# EAGLE design blinds_new (EAGLE 8.6.0)
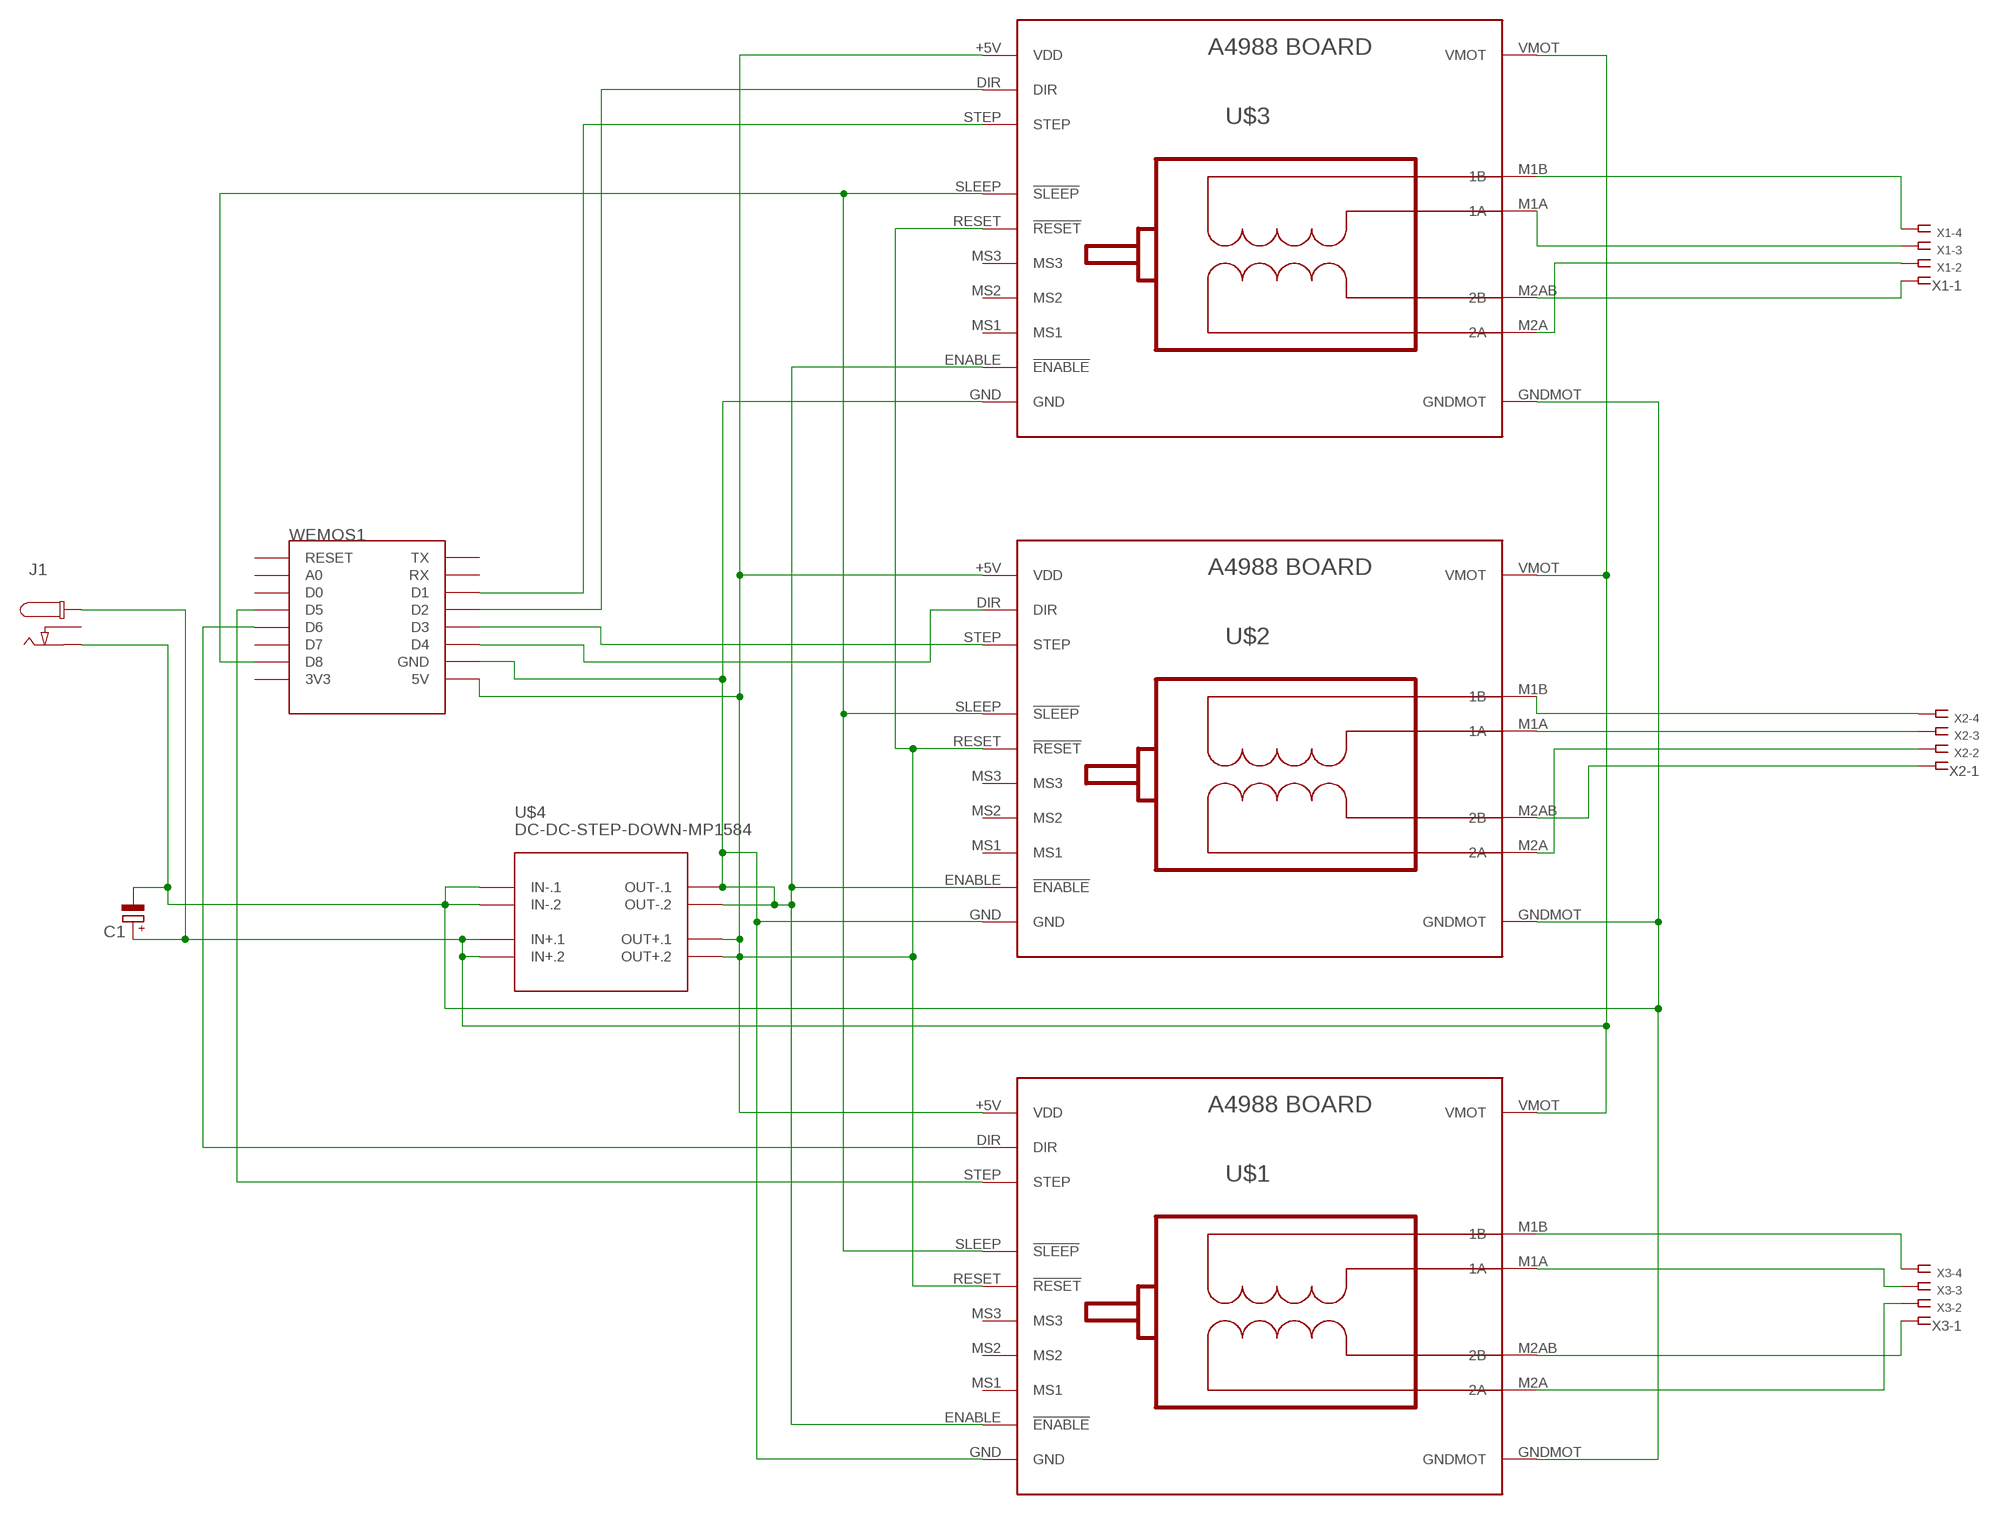
[diagram p0: schematic, sheet 1]

## Parts
C1  CPOL-EUE1.8-4  [E1,8-4]
J1  CON_DC_M-DC_SMD  [DC_BARREL_JACK_SMD_2MM]
U$1  BOARD_A4988  [BOARD_A4988]
U$2  BOARD_A4988  [BOARD_A4988]
U$3  BOARD_A4988  [BOARD_A4988]
U$4  DC-DC-STEP-DOWN-MP1584  [DC-DC-STEP-DOWN-MP1584]
WEMOS1  WEMOS-D1-MINI  [WEMOS-D1-MINI]
X1  SSW-104-02-S-S  [SSW-104-02-S-S]
X2  SSW-104-02-S-S  [SSW-104-02-S-S]
X3  SSW-104-02-S-S  [SSW-104-02-S-S]

## Nets
N$1: U$1.+5V(VDD) U$1.RESET(!RESET) U$2.+5V(VDD) U$2.RESET(!RESET) U$3.+5V(VDD) U$3.RESET(!RESET) U$4.OUT+.1 U$4.OUT+.2 WEMOS1.5V
N$2: U$1.ENABLE(!ENABLE) U$1.GND U$2.ENABLE(!ENABLE) U$2.GND U$3.ENABLE(!ENABLE) U$3.GND U$4.OUT-.1 U$4.OUT-.2 WEMOS1.GND
N$3: U$3.M1B(1B) X1.4
N$4: U$3.M1A(1A) X1.3
N$5: U$1.M2A(2A) X3.2
N$6: U$1.M2AB(2B) X3.1
N$7: U$2.M1B(1B) X2.4
N$8: U$2.M1A(1A) X2.3
N$9: U$2.M2AB(2B) X2.1
N$10: U$2.M2A(2A) X2.2
N$11: U$1.M1B(1B) X3.4
N$12: U$1.M1A(1A) X3.3
N$13: U$3.M2AB(2B) X1.1
N$14: U$3.M2A(2A) X1.2
N$15: U$1.SLEEP(!SLEEP) U$2.SLEEP(!SLEEP) U$3.SLEEP(!SLEEP) WEMOS1.D8
N$18: C1.- J1.P2 U$1.GNDMOT U$2.GNDMOT U$3.GNDMOT U$4.IN-.1 U$4.IN-.2
N$19: U$3.STEP WEMOS1.D1
N$20: U$3.DIR WEMOS1.D2
N$21: U$2.STEP WEMOS1.D3
N$22: U$2.DIR WEMOS1.D4
N$23: U$1.STEP WEMOS1.D5
N$24: U$1.DIR WEMOS1.D6
N$32: C1.+ J1.P1@2(P1) U$1.VMOT U$2.VMOT U$3.VMOT U$4.IN+.1 U$4.IN+.2
Unconnected: J1.P3 U$1.MS1 U$1.MS2 U$1.MS3 U$2.MS1 U$2.MS2 U$2.MS3 U$3.MS1 U$3.MS2 U$3.MS3 WEMOS1.3V3 WEMOS1.A0 WEMOS1.D0 WEMOS1.D7 WEMOS1.RESET WEMOS1.RX WEMOS1.TX

## Library data of the parts
C1 = rcl:CPOL-EU: POLARIZED CAPACITOR, European symbol; SPICEPREFIX: C
J1 = dp_devices.v6:CON_DC_M: DC power connector
U$1-U$3 = Clean-Kong:BOARD_A4988
U$4 = diy-modules:DC-DC-STEP-DOWN-MP1584: DC/DC Step-Down Regulator based on MP1584 chip MP1584 datasheet available here: http://www.haoyuelectronics.com/Attachment/MP1584/MP1584.pdf Click here to find device on ebay.com <http://www.ebay.com/sch/mp1584+module>
WEMOS1 = esp8266modules:WEMOS-D1-MINI: WeMos.cc D1 mini ESP8266 module
X1-X3 = Clean-Kong:SSW-104-02-S-S: THROUGH-HOLE .025" SQ POST SOCKET Source: Samtec SSW.pdf; MPN: SSW-104-02-S-S; OC_FARNELL: unknown; OC_NEWARK: 11P9384

## Board
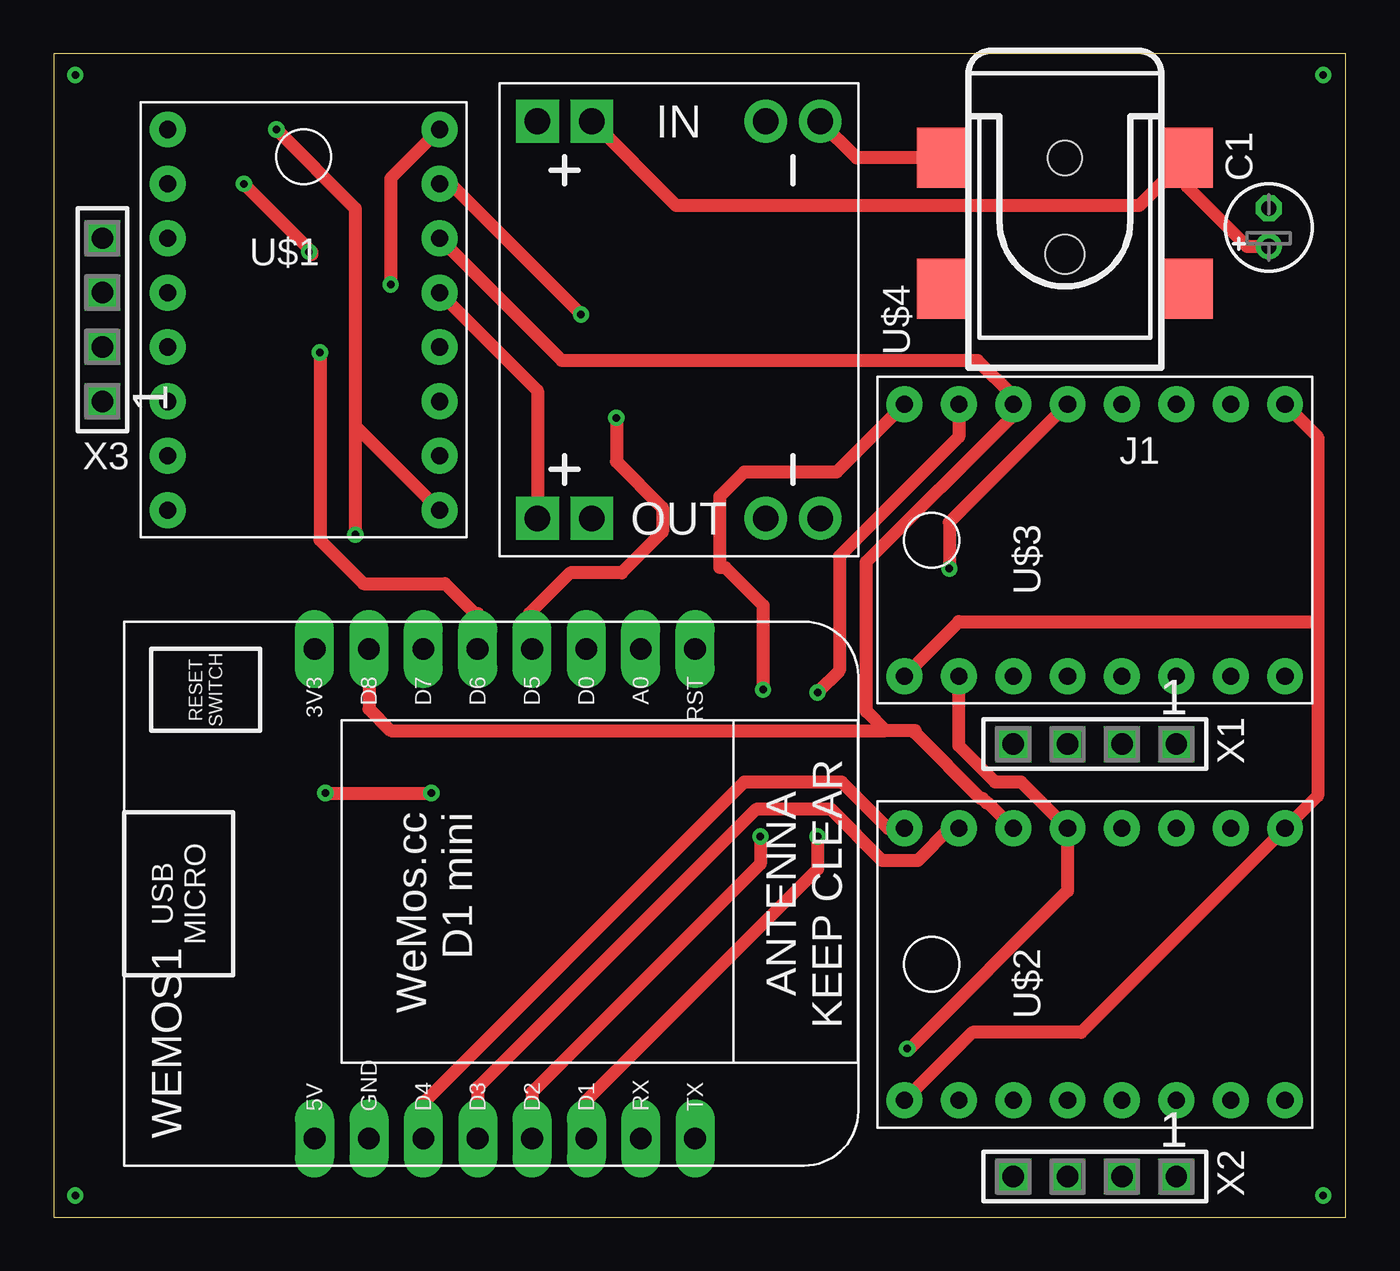
[diagram p1: board, top side]
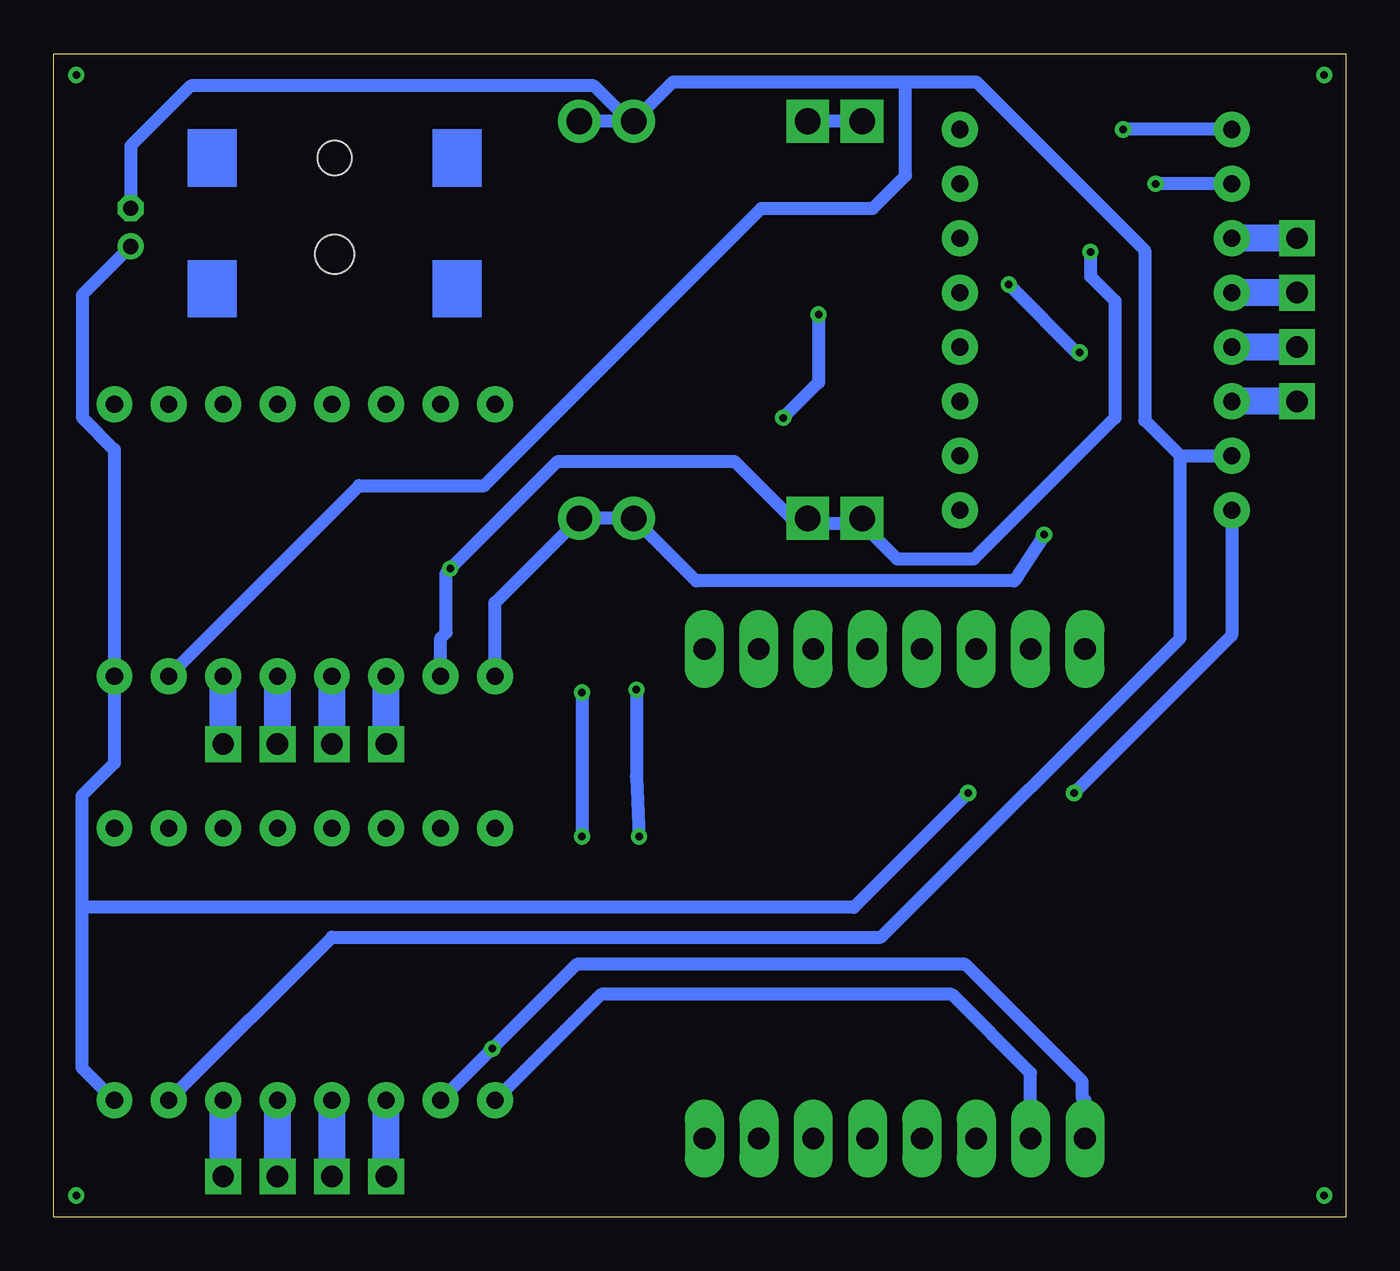
[diagram p2: board, bottom side, seen from below]

Size 60.38 x 54.35 mm. Coordinates in mm from the lower left corner, seen from the top.
Outline: 0,0 60.38,0 60.38,54.35 0,54.35 0,0
Copper layers (1*16): Top 0.035mm / dielectric 1.5mm / Bottom 0.035mm
Design rules "default": minimum track width 24mil, minimum drill 0.8mm, track to track 14mil, track to pad 14mil, pad to pad 14mil, via to via 14mil, smd to smd 6mil, copper to edge 40mil, drill to drill 6mil, minimum pad ring 10mil, minimum via ring 8mil, stop-mask expansion 4mil, vias tented up to drill 0mil, thermal gap 10mil

### Footprints (pad centres in the part's own frame; a part is rotated, then mirrored left to right if it is on the bottom)
E1,8-4 = drill 0.711 pad 1.168: + -0.889,0 | drill 0.711 pad 1.168 octagon: - 0.889,0
DC_BARREL_JACK_SMD_2MM = smd 2.4 x 2.8: P1@1 -5.7,3.875; P1@2 -5.7,-2.225; P2 5.7,-2.225; P3 5.7,3.875 | hole 1.8: 0,2.275 | hole 1.6: 0,-2.225
BOARD_A4988 = drill 0.8 pad 1.676: +5V 1.27,16.51; DIR 13.97,19.05; ENABLE 13.97,1.27; GND 1.27,19.05; GNDMOT 1.27,3.81; M1A 1.27,11.43; M1B 1.27,13.97; M2A 1.27,8.89; M2AB 1.27,6.35; MS1 13.97,3.81; MS2 13.97,6.35; MS3 13.97,8.89; RESET 13.97,11.43; SLEEP 13.97,13.97; STEP 13.97,16.51; VMOT 1.27,1.27
DC-DC-STEP-DOWN-MP1584 = drill 1.2 pad 2 square: IN+.1 -9.271,-4.064; IN+.2 -9.271,-6.604; OUT+.1 9.271,-4.064; OUT+.2 9.271,-6.604 | drill 1.2 pad 2: IN-.1 -9.271,6.604; IN-.2 -9.271,4.064; OUT-.1 9.271,6.604; OUT-.2 9.271,4.064
WEMOS-D1-MINI = drill 1.016 pad 1.829 long: 3V3 -10.16,-10.16; 5V 12.7,-10.16; A0 -10.16,5.08; D0 -10.16,2.54; D1 12.7,2.54; D2 12.7,0; D3 12.7,-2.54; D4 12.7,-5.08; D5 -10.16,0; D6 -10.16,-2.54; D7 -10.16,-5.08; D8 -10.16,-7.62; GND 12.7,-7.62; RESET -10.16,7.62; RX 12.7,5.08; TX 12.7,7.62
SSW-104-02-S-S = drill 1 pad 1.676 square: 1 -3.81,0; 2 -1.27,0; 3 1.27,0; 4 3.81,0

### Placement (x,y rotation side)
C1  56.77,46.23 90 top
J1  47.24,47.24 180 top
U$1  4.06,31.75 0 top
U$2  58.8,4.19 90 top
U$3  58.8,24 90 top
U$4  29.21,41.91 270 top
WEMOS1  22.35,16.38 270 top
X1  48.64,22.1 180 top
X2  48.64,1.91 180 top
X3  2.29,41.91 90 top

### Tracks (layer width: path | path; a pad name or v marks a point on that pad's centre or on a via)
N$1  (via drill 0.35)
  Top 0.61: v8.89,48.26 12.06,45.09 12.06,44.96 v11.94,45.09 | U$3.RESET 41.85,32.45 v41.85,30.29 | v39.88,7.87 40.01,7.87 47.37,15.24 U$2.RESET 45.21,20.32 44,20.32 42.29,22.03 U$3.+5V | U$1.RESET 22.61,38.61 U$4.OUT+.2
  Bottom 0.61: WEMOS1.5V 12.19,5.46 12.32,5.59 12.32,6.35 17.78,11.81 35.94,11.81 v39.88,7.87 U$2.+5V | U$3.+5V 42.29,27.05 42.04,27.3 42.04,30.1 v41.85,30.29 36.83,35.31 28.57,35.31 25.91,32.64 U$4.OUT+.1 24.89,32.38 22.86,32.38 U$4.OUT+.2 22.61,32.38 20.95,30.73 17.4,30.73 10.79,37.34 10.79,42.8 11.94,43.94 v11.94,45.09 | U$1.+5V v8.89,48.26
N$2  (via drill 0.35)
  Top 0.61: v10.41,50.8 14.1,47.12 14.1,36.96 | 14.1,36.96 v14.1,31.88 | U$1.ENABLE 14.1,36.96 | U$3.ENABLE 59.05,36.45 59.05,27.81 | 59.05,27.81 59.05,19.68 U$2.ENABLE 48.01,8.64 42.93,8.64 U$2.GND | U$3.GND 42.29,27.81 59.05,27.81
  Bottom 0.61: WEMOS1.GND 14.73,6.73 18.41,10.41 34.8,10.41 U$2.GND | U$3.GND 39.75,28.7 U$4.OUT-.1 U$4.OUT-.2 30.35,29.72 15.49,29.72 v14.1,31.88 | U$1.GND v10.41,50.8
N$3
  Bottom 1.27: X1.4 U$3.M1B
N$4
  Bottom 1.27: X1.3 U$3.M1A
N$5
  Bottom 1.27: X3.2 U$1.M2A
N$6
  Bottom 1.27: X3.1 U$1.M2AB
N$7
  Bottom 1.27: X2.4 U$2.M1B
N$8
  Bottom 1.27: X2.3 U$2.M1A
N$9
  Bottom 1.27: X2.1 U$2.M2AB
N$10
  Bottom 1.27: X2.2 U$2.M2A
N$11
  Bottom 1.27: X3.4 U$1.M1B
N$12
  Bottom 1.27: X3.3 U$1.M1A
N$13
  Bottom 1.27: X1.1 U$3.M2AB
N$14
  Bottom 1.27: X1.2 U$3.M2A
N$15
  Top 0.61: 38.86,22.73 40.26,22.73 40.26,22.61 43.31,19.56 43.4,19.56 43.6,19.36 43.64,19.36 U$2.SLEEP | 38.86,22.73 37.97,23.62 37.97,30.61 44.83,37.47 U$3.SLEEP 44.83,38.35 43.18,40.01 23.75,40.01 U$1.SLEEP | WEMOS1.D8 14.73,23.75 15.75,22.73 38.86,22.73
N$16  (via drill 0.35)
  other vias: 1.02,1.02
N$18
  Top 0.61: J1.P2 37.53,49.47 U$4.IN-.1
  Bottom 0.61: U$4.IN-.2 31.43,53.02 20.57,53.02 | 20.57,53.02 17.27,53.02 9.4,45.15 9.4,37.21 7.75,35.56 | 7.75,35.56 U$1.GNDMOT | U$4.IN-.2 33.47,51.18 35.13,52.84 53.97,52.84 56.77,50.04 C1.- | U$4.IN-.2 U$4.IN-.1 | U$2.GNDMOT 47.37,13.08 21.72,13.08 7.75,27.05 7.75,35.56 | U$3.GNDMOT 46.1,34.16 40.26,34.16 27.3,47.12 22.1,47.12 20.57,48.64 20.57,53.02
N$19  (via drill 0.35)
  Top 0.61: U$3.STEP 42.29,36.45 36.7,30.86 36.7,25.53 v35.69,24.51 | v35.69,17.78 35.69,16.26 24.89,5.46 WEMOS1.D1
  Bottom 0.61: v35.69,24.51 v35.69,17.78
N$20  (via drill 0.35)
  Top 0.61: U$3.DIR 36.58,34.8 32.26,34.8 31.11,33.66 31.11,30.35 31.37,30.35 33.15,28.57 v33.15,24.64 | v33.02,17.78 33.02,16.51 22.35,5.84 WEMOS1.D2
  Bottom 0.61: v33.15,24.64 33.15,20.57 v33.02,17.78
N$21
  Top 0.61: U$2.STEP 41.87,18.16 40.37,16.66 38.71,16.66 36.32,19.05 32.82,19.05 19.87,6.1 19.81,6.1 WEMOS1.D3
N$22
  Top 0.61: U$2.DIR 38.99,18.16 36.83,20.32 32.26,20.32 17.27,5.33 WEMOS1.D4
N$23  (via drill 0.35)
  Top 0.61: U$1.STEP 18.54,48.26 v24.64,42.16 | v26.29,37.34 26.29,35.31 28.45,33.15 28.45,32 26.54,30.1 24.13,30.1 22.23,28.19 22.35,28.07 WEMOS1.D5
  Bottom 0.61: v24.64,42.16 24.64,38.99 v26.29,37.34
N$24  (via drill 0.35)
  Top 0.61: U$1.DIR 15.75,48.51 v15.75,43.56 | v12.45,40.39 12.45,31.62 14.48,29.59 18.29,29.59 19.68,28.19 19.81,28.19 WEMOS1.D6
  Bottom 0.61: v15.75,43.56 12.45,40.26 v12.45,40.39
N$28  (via drill 0.35)
  other vias: 59.31,1.02
N$29  (via drill 0.35)
  other vias: 59.31,53.34
N$30  (via drill 0.35)
  other vias: 1.02,53.34
N$32  (via drill 0.35)
  Top 0.61: v12.7,19.81 v17.65,19.81 | U$4.IN+.1 29.08,47.24 50.72,47.24 J1.P1@2 52.94,48.15 55.75,45.34 C1.+
  Bottom 0.61: C1.+ 59.03,43.08 59.03,37.35 57.53,35.85 U$3.VMOT 57.53,21.21 59.05,19.68 59.05,14.48 | U$2.VMOT 59.05,6.99 59.05,14.48 | U$4.IN+.2 U$4.IN+.1 | U$1.VMOT 5.33,27.18 v12.7,19.81 | v17.65,19.81 22.99,14.48 59.05,14.48
(copper drawn outside any net)
  shapes: Bottom area x8